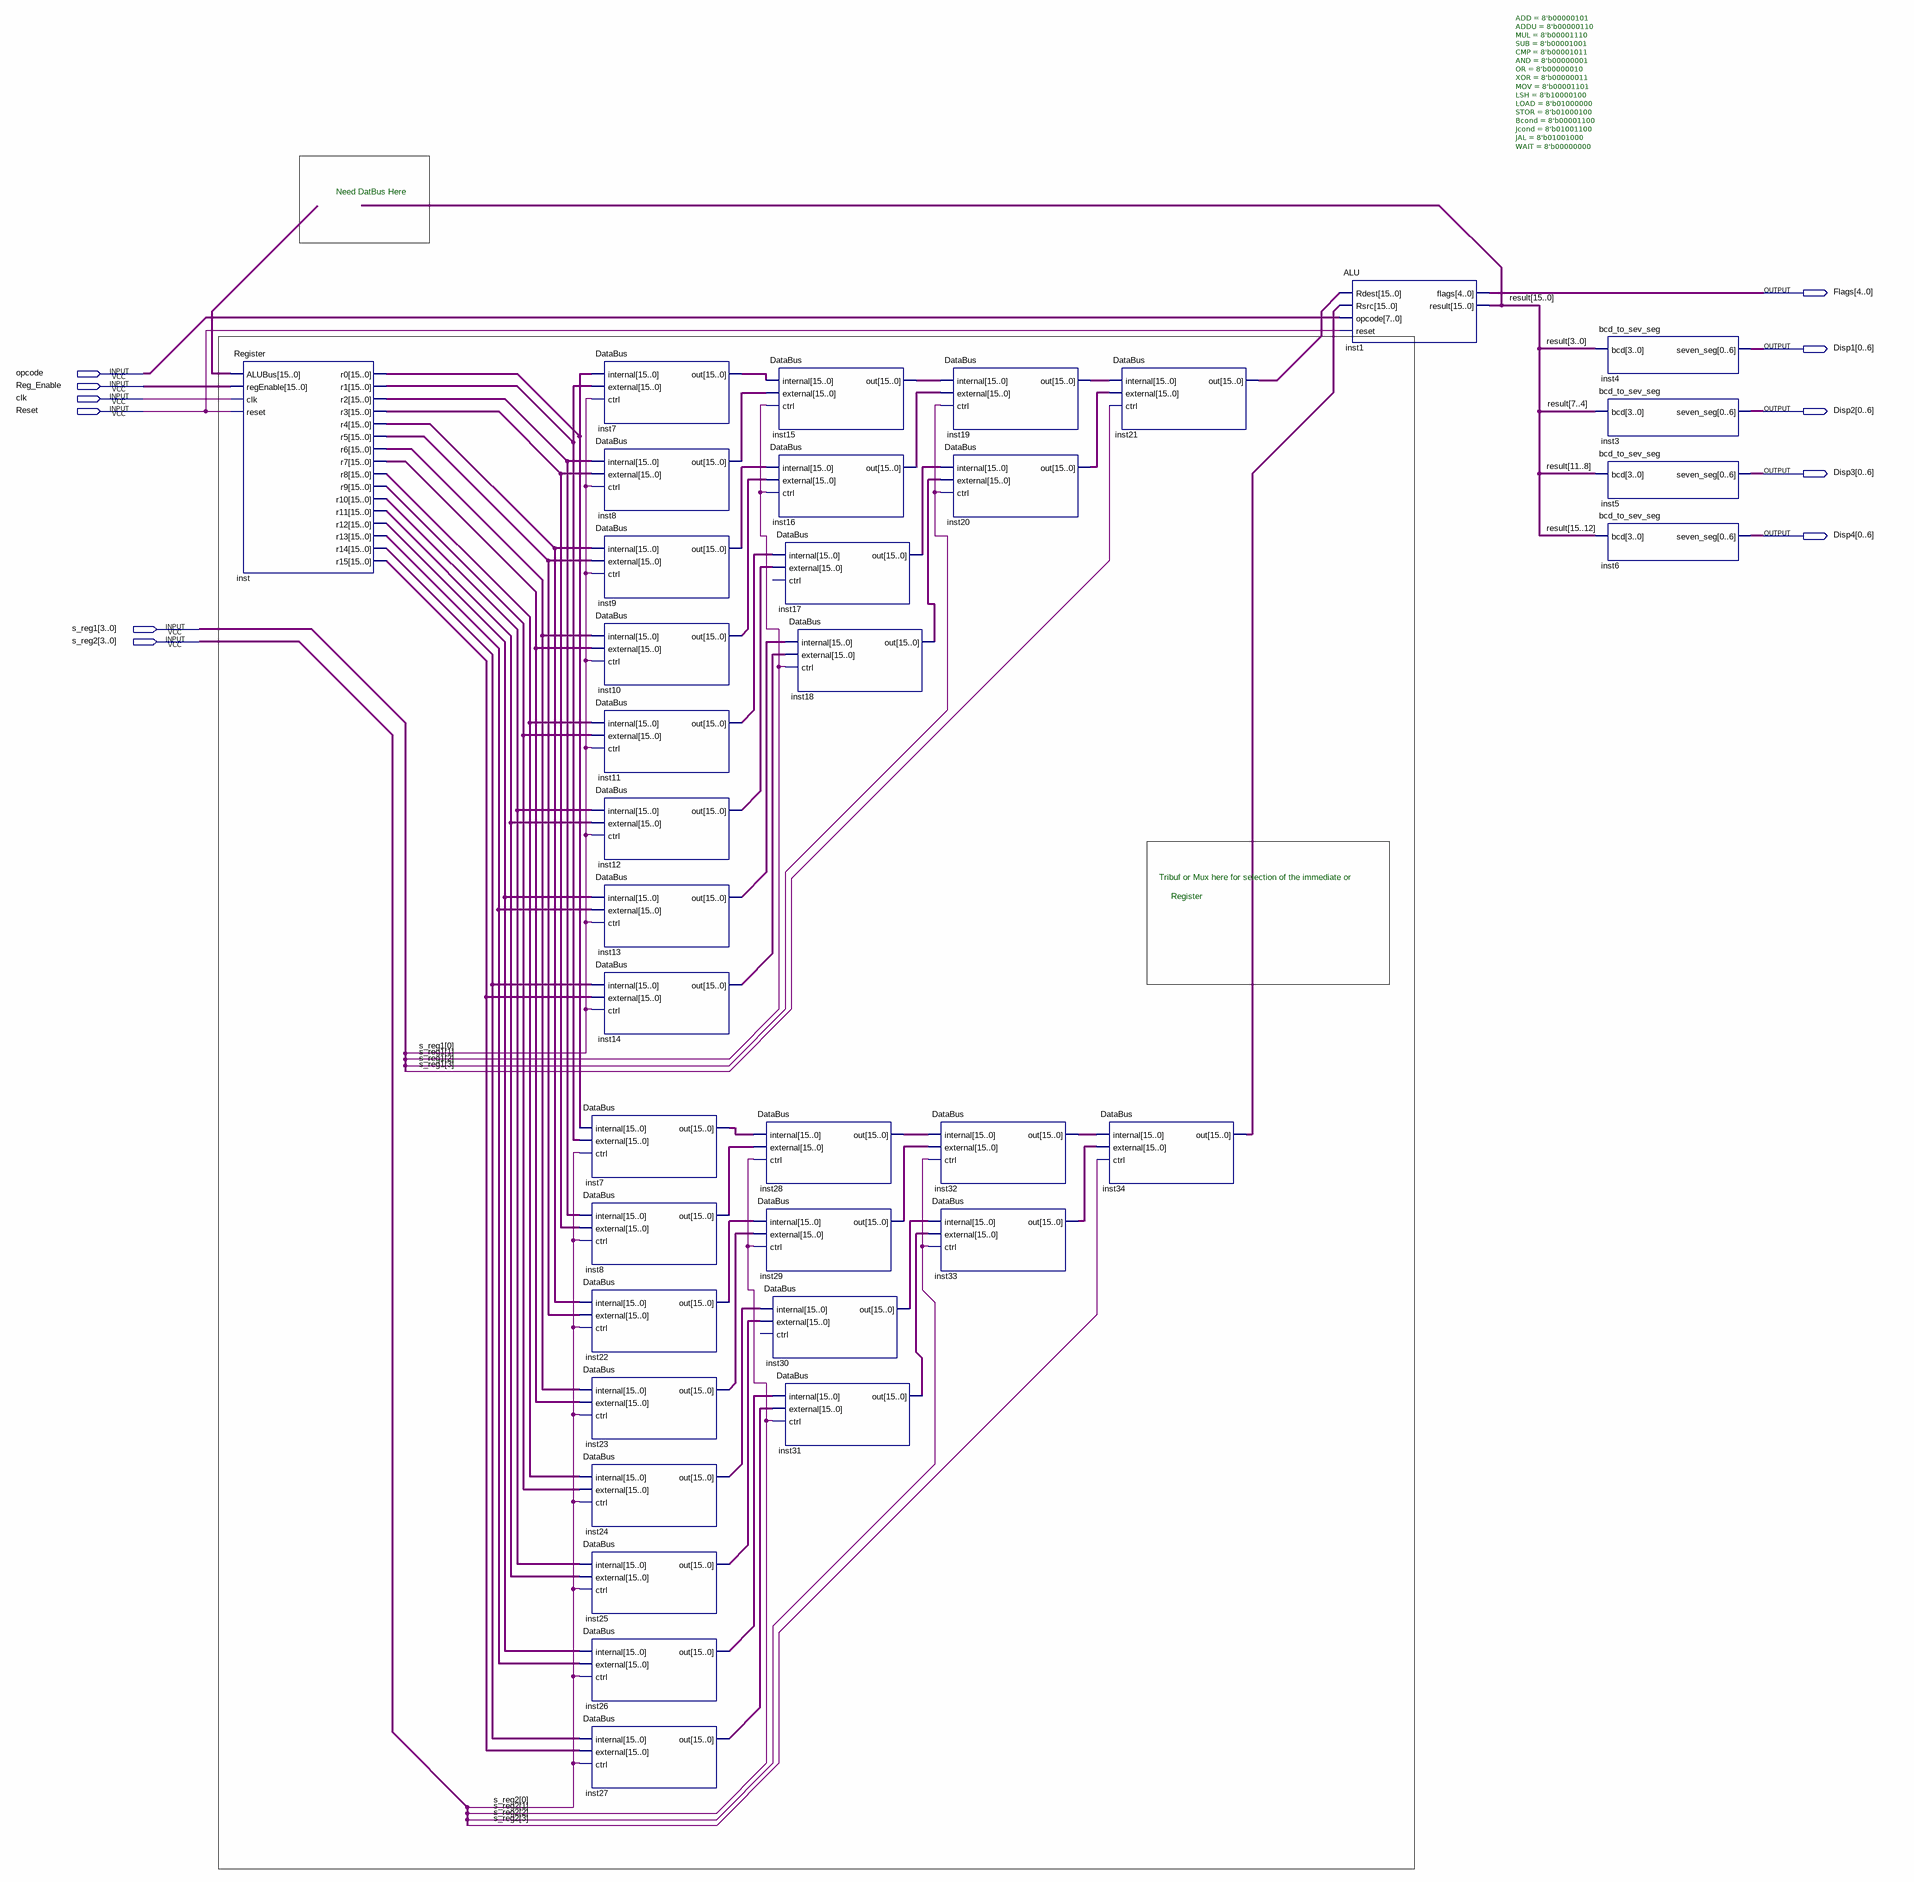
[diagram p0: schematic sheet]
// Quartus schematic ALU_REG_BLOCK_Test.bdf as structural Verilog: 36 symbols, 11 pins
module ALU_REG_BLOCK_Test (
  input  opcode,
  input  Reg_Enable,
  input  clk,
  input  Reset,
  input  [3:0] s_reg1,
  input  [3:0] s_reg2,
  output [4:0] Flags,
  output [0:6] Disp1,
  output [0:6] Disp2,
  output [0:6] Disp3,
  output [0:6] Disp4
);

  wire [7:0] undriven;
  wire [15:0] inst7_out, inst7_out_2, inst8_out, inst8_out_2, inst9_out, inst10_out, inst11_out, inst12_out,
       inst13_out, inst14_out, inst15_out, inst16_out, inst17_out, inst18_out, inst19_out, inst20_out,
       inst21_out, inst22_out, inst23_out, inst24_out, inst25_out, inst26_out, inst27_out, inst28_out,
       inst29_out, inst30_out, inst31_out, inst32_out, inst33_out, inst34_out, inst_r0, inst_r1, inst_r2,
       inst_r3, inst_r4, inst_r5, inst_r6, inst_r7, inst_r8, inst_r9, inst_r10, inst_r11, inst_r12, inst_r13,
       inst_r14, inst_r15, result, undriven_2, undriven_3;

  Register inst (
    .ALUBus(undriven_3), .regEnable(undriven_2), .clk(clk), .reset(Reset), .r0(inst_r0), .r1(inst_r1),
    .r2(inst_r2), .r3(inst_r3), .r4(inst_r4), .r5(inst_r5), .r6(inst_r6), .r7(inst_r7), .r8(inst_r8),
    .r9(inst_r9), .r10(inst_r10), .r11(inst_r11), .r12(inst_r12), .r13(inst_r13), .r14(inst_r14),
    .r15(inst_r15));
  DataBus inst7 (.internal(inst_r0), .external(inst_r1), .ctrl(s_reg1[0]), .out(inst7_out_2));
  DataBus inst8 (.internal(inst_r2), .external(inst_r3), .ctrl(s_reg1[0]), .out(inst8_out));
  DataBus inst9 (.internal(inst_r4), .external(inst_r5), .ctrl(s_reg1[0]), .out(inst9_out));
  DataBus inst10 (.internal(inst_r6), .external(inst_r7), .ctrl(s_reg1[0]), .out(inst10_out));
  DataBus inst11 (.internal(inst_r8), .external(inst_r9), .ctrl(s_reg1[0]), .out(inst11_out));
  DataBus inst12 (.internal(inst_r10), .external(inst_r11), .ctrl(s_reg1[0]), .out(inst12_out));
  DataBus inst13 (.internal(inst_r12), .external(inst_r13), .ctrl(s_reg1[0]), .out(inst13_out));
  DataBus inst14 (.internal(inst_r14), .external(inst_r15), .ctrl(s_reg1[0]), .out(inst14_out));
  DataBus inst7_dup2 (.internal(inst_r0), .external(inst_r1), .ctrl(s_reg2[0]), .out(inst7_out));
  DataBus inst8_dup2 (.internal(inst_r2), .external(inst_r3), .ctrl(s_reg2[0]), .out(inst8_out_2));
  DataBus inst22 (.internal(inst_r4), .external(inst_r5), .ctrl(s_reg2[0]), .out(inst22_out));
  DataBus inst23 (.internal(inst_r6), .external(inst_r7), .ctrl(s_reg2[0]), .out(inst23_out));
  DataBus inst24 (.internal(inst_r8), .external(inst_r9), .ctrl(s_reg2[0]), .out(inst24_out));
  DataBus inst25 (.internal(inst_r10), .external(inst_r11), .ctrl(s_reg2[0]), .out(inst25_out));
  DataBus inst26 (.internal(inst_r12), .external(inst_r13), .ctrl(s_reg2[0]), .out(inst26_out));
  DataBus inst27 (.internal(inst_r14), .external(inst_r15), .ctrl(s_reg2[0]), .out(inst27_out));
  DataBus inst28 (.internal(inst7_out), .external(inst8_out_2), .ctrl(s_reg2[1]), .out(inst28_out));
  DataBus inst29 (.internal(inst22_out), .external(inst23_out), .ctrl(s_reg2[1]), .out(inst29_out));
  DataBus inst30 (.internal(inst24_out), .external(inst25_out), .out(inst30_out));  // open: ctrl
  DataBus inst15 (.internal(inst7_out_2), .external(inst8_out), .ctrl(s_reg1[1]), .out(inst15_out));
  DataBus inst16 (.internal(inst9_out), .external(inst10_out), .ctrl(s_reg1[1]), .out(inst16_out));
  DataBus inst17 (.internal(inst11_out), .external(inst12_out), .out(inst17_out));  // open: ctrl
  DataBus inst18 (.internal(inst13_out), .external(inst14_out), .ctrl(s_reg1[1]), .out(inst18_out));
  DataBus inst31 (.internal(inst26_out), .external(inst27_out), .ctrl(s_reg2[1]), .out(inst31_out));
  DataBus inst19 (.internal(inst15_out), .external(inst16_out), .ctrl(s_reg1[2]), .out(inst19_out));
  DataBus inst20 (.internal(inst17_out), .external(inst18_out), .ctrl(s_reg1[2]), .out(inst20_out));
  DataBus inst32 (.internal(inst28_out), .external(inst29_out), .ctrl(s_reg2[2]), .out(inst32_out));
  DataBus inst33 (.internal(inst30_out), .external(inst31_out), .ctrl(s_reg2[2]), .out(inst33_out));
  DataBus inst21 (.internal(inst19_out), .external(inst20_out), .ctrl(s_reg1[3]), .out(inst21_out));
  DataBus inst34 (.internal(inst32_out), .external(inst33_out), .ctrl(s_reg2[3]), .out(inst34_out));
  ALU #(.ADD(8'b00000101), .ADDU(8'b00000110), .MUL(8'b00001110), .SUB(8'b00001001), .CMP(8'b00001011), .AND(8'b00000001), .OR(8'b00000010), .XOR(8'b00000011), .MOV(8'b00001101), .LSH(8'b10000100), .LOAD(8'b01000000), .STOR(8'b01000100), .Bcond(8'b00001100), .Jcond(8'b01001100), .JAL(8'b01001000), .WAIT(8'b00000000)) inst1 (
    .Rdest(inst21_out), .Rsrc(inst34_out), .opcode(undriven), .reset(Reset), .flags(Flags), .result(result));
  bcd_to_sev_seg inst4 (.bcd(result[3:0]), .seven_seg(Disp1));
  bcd_to_sev_seg inst3 (.bcd(result[7:4]), .seven_seg(Disp2));
  bcd_to_sev_seg inst5 (.bcd(result[11:8]), .seven_seg(Disp3));
  bcd_to_sev_seg inst6 (.bcd(result[15:12]), .seven_seg(Disp4));

  // Notes on the sheet:
  //   Need DatBus Here
  //   Tribuf or Mux here for selection of the immediate or 
  //   Register
endmodule
